# EAGLE schematic DS18B20exampleSerial (EAGLE 7.3.0)
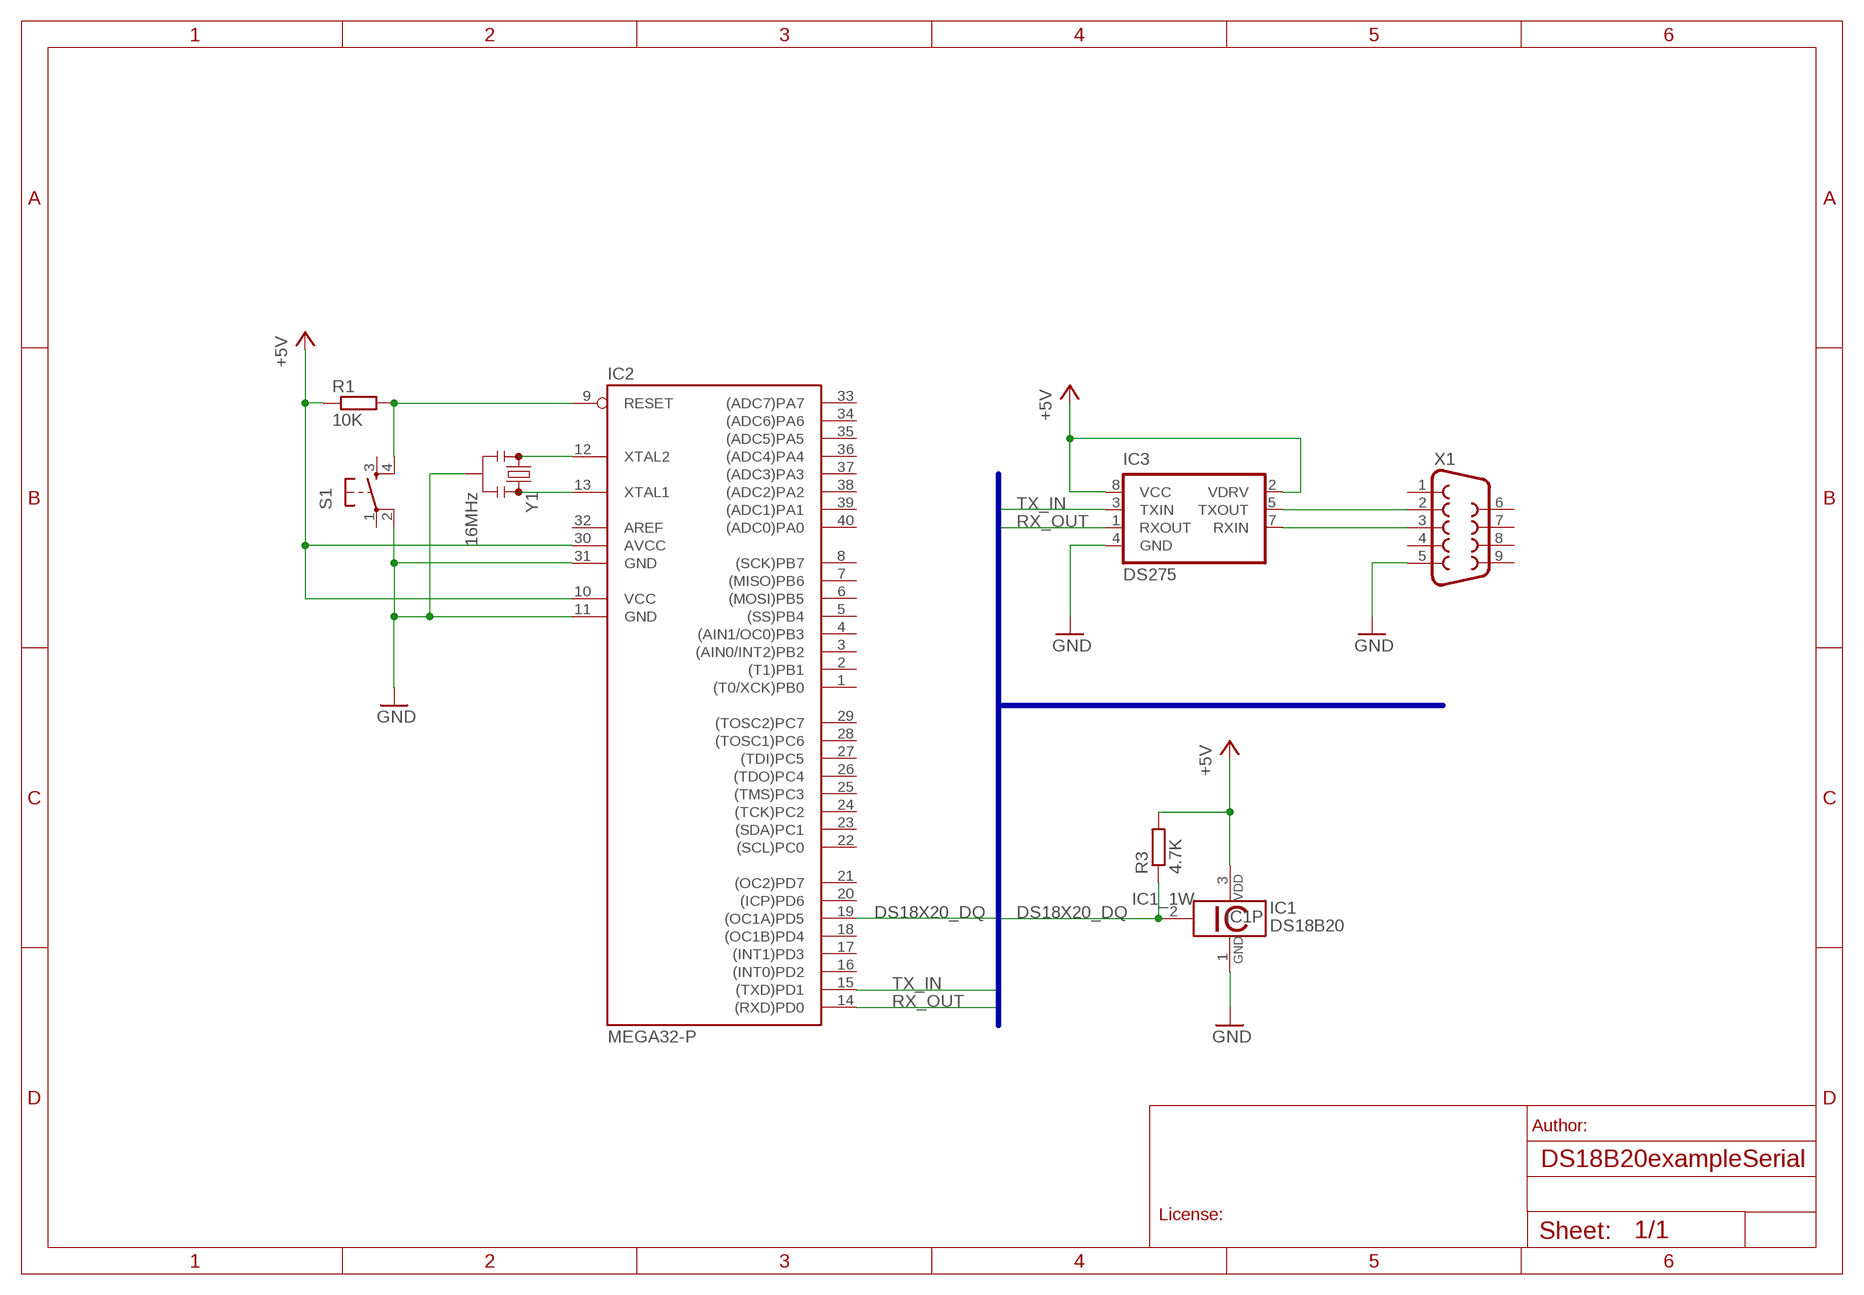
[diagram p0: schematic, sheet 1]
FRAME1 (A4L-LOC): AUTHOR: positroni57; DESCRIPTION_LINE1: Test circuit for DS18S20Library.; DESCRIPTION_LINE2: Temperature reading from DS18B20/DS18S20; DESCRIPTION_LINE3: is send by Atmega32 to a sreial port.; LICENSE_LINE1: Creative Commons; LICENSE_LINE2: (BY) (NC) (SA)

## Parts
IC1  DS18B20  [TO92-]
IC2  MEGA32-P  [DIL40]
IC3  DS275  [DIL08]
R1  10K  R-EU_0204/7  [0204/7]
R3  4.7K  R-EU_0204/7  [0204/7]
S1  TAC_SWITCHPTH  [TACTILE-PTH]
X1  F09HP  [F09HP]
Y1  16MHz  RESONATORPTH  [RESONATOR-PTH]

## Nets
+5V: IC1.3 IC2.10(VCC) IC2.30(AVCC) IC3.2(VDRV) IC3.8(VCC) R1.1 R3.2
DS18X20_DQ: IC1.2 IC2.19((OC1A)PD5) R3.1
GND: IC1.1 IC2.11(GND) IC2.31(GND) IC3.4(GND) S1.2 X1.5 Y1.2
N$1: IC2.13(XTAL1) Y1.3
N$2: IC2.12(XTAL2) Y1.1
N$3: IC2.9(RESET) R1.2 S1.4
N$4: IC3.5(TXOUT) X1.2
N$5: IC3.7(RXIN) X1.3
RX_OUT: IC2.14((RXD)PD0) IC3.1(RXOUT)
TX_IN: IC2.15((TXD)PD1) IC3.3(TXIN)
Unconnected: IC2.1((T0/XCK)PB0) IC2.2((T1)PB1) IC2.3((AIN0/INT2)PB2) IC2.4((AIN1/OC0)PB3) IC2.5((SS)PB4) IC2.6((MOSI)PB5) IC2.7((MISO)PB6) IC2.8((SCK)PB7) IC2.16((INT0)PD2) IC2.17((INT1)PD3) IC2.18((OC1B)PD4) IC2.20((ICP)PD6) IC2.21((OC2)PD7) IC2.22((SCL)PC0) IC2.23((SDA)PC1) IC2.24((TCK)PC2) IC2.25((TMS)PC3) IC2.26((TDO)PC4) IC2.27((TDI)PC5) IC2.28((TOSC1)PC6) IC2.29((TOSC2)PC7) IC2.32(AREF) IC2.33((ADC7)PA7) IC2.34((ADC6)PA6) IC2.35((ADC5)PA5) IC2.36((ADC4)PA4) IC2.37((ADC3)PA3) IC2.38((ADC2)PA2) IC2.39((ADC1)PA1) IC2.40((ADC0)PA0) S1.1 S1.3 X1.1 X1.4 X1.6 X1.7 X1.8 X1.9

## Buses
RX_OUT,TX_IN,DS18X20_DQ

## Library data of the parts
IC1 = 1wire:DS18B20: Programmable Resolution Digital Thermometer This chip provides a onewire thermosensor with approx. 0.5°C accuracy. A programmable over/undertemperure alarm is available. The precision can be set from 9..12 bits. Notes: Vdd must be applied for accurate measurements at low temperatures, as the parasite power circuit otherwise heats the sensor. If parasite power is used, Vdd has to be connected to GND. The DS1822 is a low-cost thermometer chip, the DS18S20 is similar to the DS18B20, but with 9 Bit precision only. Author: Jan Kandziora <jjj@gmx.de>
IC2 = atmel:MEGA32-P: MICROCONTROLLER 32 Kbytes FLASH 2 Kbytes SRAM 1 Kbytes EEPROM USART 8-channel 10 bit ADC Source: www.atmel.com .. doc2503.pdf; MPN: ATMEGA32-16PU; OC_FARNELL: 1661729; OC_NEWARK: 51P1794
IC3 = maxim:DS275: Line-Powered RS-232 Transceiver Chip Source: http://www.maxim-ic.com .. DS275.pdf; MPN: DS275+; OC_FARNELL: unknown; OC_NEWARK: 88K4212
R1 R3 = resistor:R-EU_: RESISTOR, European symbol
S1 = SparkFun-Retired:TAC_SWITCH: Momentary Switch Button commonly used for reset or general input. Spark Fun Electronics SKU : COM-00097 SMT- SWCH-08247
X1 = con-subd:F09: SUB-D; OC_FARNELL: unknown; OC_NEWARK: unknown
Y1 = SparkFun-FreqCtrl:RESONATOR: Resonator Small SMD resonator. Used, eg, on the Arduino Pro/ Pro Mini boards. 8MHz- XTAL-08895 16MHz- XTAL-08900